# Altium project WS2812B_Bar.PrjPcb
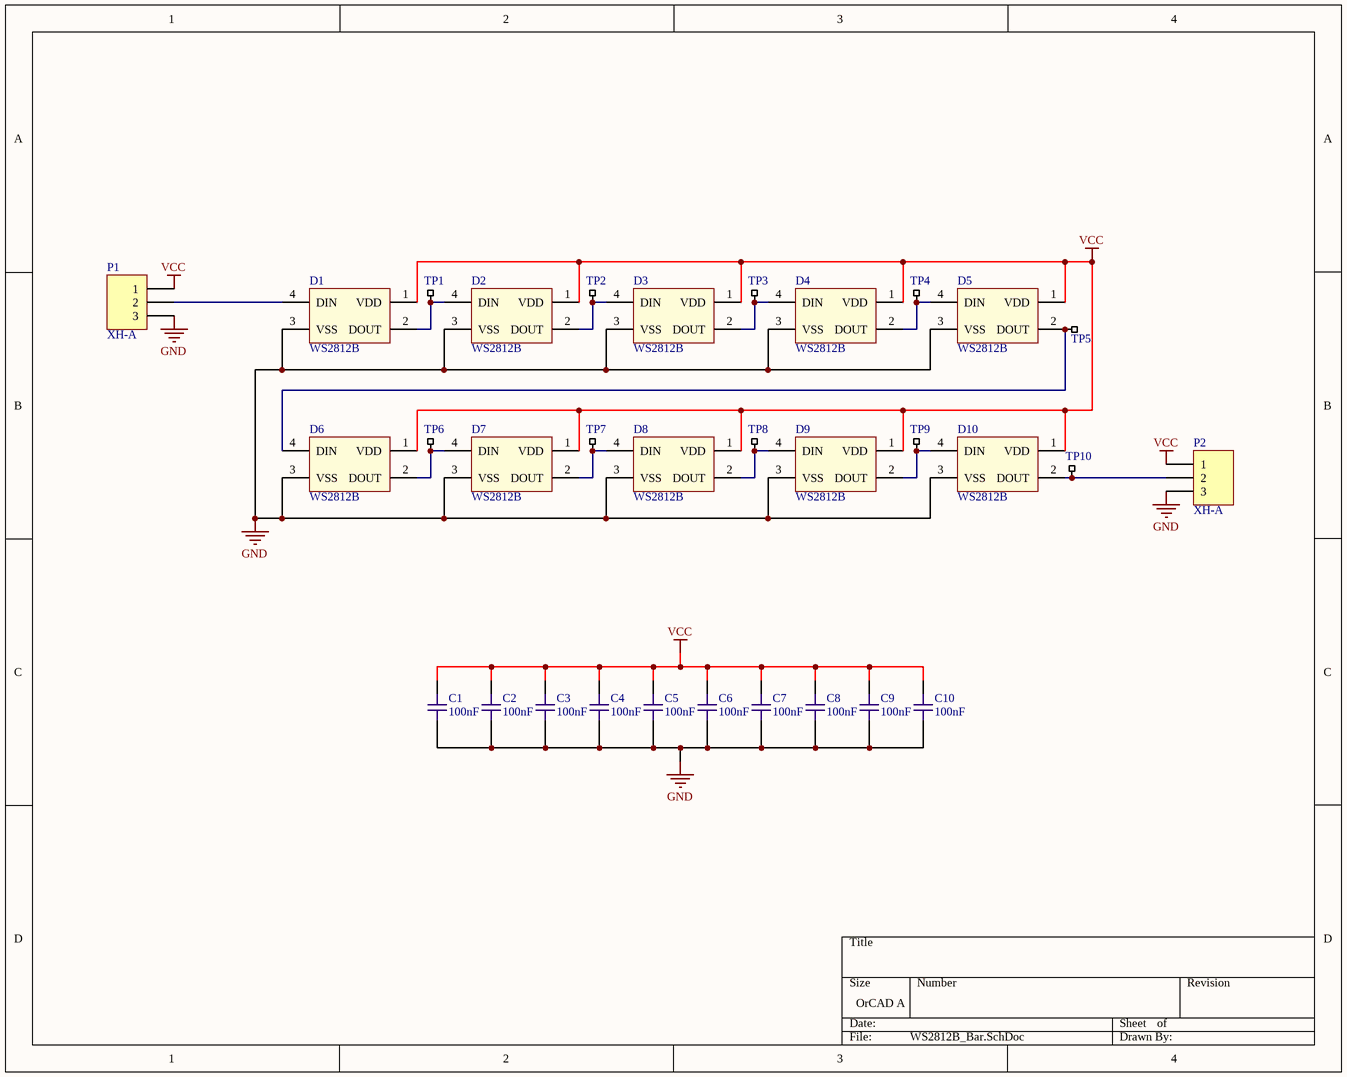
[diagram p0: WS2812B_Bar.SchDoc]
1 sheet, 32 parts. Net scope: global (net labels, ports and power ports of the same name join across sheets).
Board file: WS2812B_Bar.PcbDoc

## Sheet WS2812B_Bar.SchDoc
size OrCAD A

### Parts
C1  value 100nF  [C0603-IPC]  (hidden comment: C0603 100nF 25V X7R)
C2  value 100nF  [C0603-IPC]  (hidden comment: C0603 100nF 25V X7R)
C3  value 100nF  [C0603-IPC]  (hidden comment: C0603 100nF 25V X7R)
C4  value 100nF  [C0603-IPC]  (hidden comment: C0603 100nF 25V X7R)
C5  value 100nF  [C0603-IPC]  (hidden comment: C0603 100nF 25V X7R)
C6  value 100nF  [C0603-IPC]  (hidden comment: C0603 100nF 25V X7R)
C7  value 100nF  [C0603-IPC]  (hidden comment: C0603 100nF 25V X7R)
C8  value 100nF  [C0603-IPC]  (hidden comment: C0603 100nF 25V X7R)
C9  value 100nF  [C0603-IPC]  (hidden comment: C0603 100nF 25V X7R)
C10  value 100nF  [C0603-IPC]  (hidden comment: C0603 100nF 25V X7R)
D1  WS2812B  [WS2812B]
D2  WS2812B  [WS2812B]
D3  WS2812B  [WS2812B]
D4  WS2812B  [WS2812B]
D5  WS2812B  [WS2812B]
D6  WS2812B  [WS2812B]
D7  WS2812B  [WS2812B]
D8  WS2812B  [WS2812B]
D9  WS2812B  [WS2812B]
D10  WS2812B  [WS2812B]
P1  XH-A  [XH Header 1x3 SMD 2.5MM HORIZONTAL]
P2  XH-A  [XH Header 1x3 SMD 2.5MM HORIZONTAL]
TP1  Testpoint_SMT  [TESTPOINT_SMT]  (value not drawn)  (no BOM)
TP2  Testpoint_SMT  [TESTPOINT_SMT]  (value not drawn)  (no BOM)
TP3  Testpoint_SMT  [TESTPOINT_SMT]  (value not drawn)  (no BOM)
TP4  Testpoint_SMT  [TESTPOINT_SMT]  (value not drawn)  (no BOM)
TP5  Testpoint_SMT  [TESTPOINT_SMT]  (value not drawn)  (no BOM)
TP6  Testpoint_SMT  [TESTPOINT_SMT]  (value not drawn)  (no BOM)
TP7  Testpoint_SMT  [TESTPOINT_SMT]  (value not drawn)  (no BOM)
TP8  Testpoint_SMT  [TESTPOINT_SMT]  (value not drawn)  (no BOM)
TP9  Testpoint_SMT  [TESTPOINT_SMT]  (value not drawn)  (no BOM)
TP10  Testpoint_SMT  [TESTPOINT_SMT]  (value not drawn)  (no BOM)

### Nets
GND: C1.1 C2.1 C3.1 C4.1 C5.1 C6.1 C7.1 C8.1 C9.1 C10.1 D1.3(VSS) D2.3(VSS) D3.3(VSS) D4.3(VSS) D5.3(VSS) D6.3(VSS) D7.3(VSS) D8.3(VSS) D9.3(VSS) D10.3(VSS) P1.3 P2.3
VCC: C1.2 C2.2 C3.2 C4.2 C5.2 C6.2 C7.2 C8.2 C9.2 C10.2 D1.1(VDD) D2.1(VDD) D3.1(VDD) D4.1(VDD) D5.1(VDD) D6.1(VDD) D7.1(VDD) D8.1(VDD) D9.1(VDD) D10.1(VDD) P1.1 P2.1
NetD1_2: D1.2(DOUT) D2.4(DIN) TP1.1
NetD1_4: D1.4(DIN) P1.2
NetD2_2: D2.2(DOUT) D3.4(DIN) TP2.1
NetD3_2: D3.2(DOUT) D4.4(DIN) TP3.1
NetD4_2: D4.2(DOUT) D5.4(DIN) TP4.1
NetD5_2: D5.2(DOUT) D6.4(DIN) TP5.1
NetD6_2: D6.2(DOUT) D7.4(DIN) TP6.1
NetD7_2: D7.2(DOUT) D8.4(DIN) TP7.1
NetD8_2: D8.2(DOUT) D9.4(DIN) TP8.1
NetD9_2: D9.2(DOUT) D10.4(DIN) TP9.1
NetD10_2: D10.2(DOUT) P2.2 TP10.1

### Library data of the parts
C1-C10 = C0603 100nF 25V X7R: Chip Capacitor, 0603, 100nF, 25V, X7R; EIA Code: X7R; Max. Voltage: 25V; Supplier 1: Digi-Key; Supplier Part Number 1: 490-1524-1-ND
D1-D10 = WS2812B: Addressable Lighting - Discrete Serial Red, Green, Blue (RGB) 5.00mm L x 5.00mm WS2812B; Supplier 1: Digi-Key; Supplier 3: LCSC; Supplier Part Number 2: 485-1655; Supplier Part Number 1: 1528-1104-ND; Supplier 2: Mouser; Supplier Part Number 3: C114586
P1 P2 = JST XH 1x3: XH Header Male Pin 0.098"(2.50mm) 3 Wire To Board / Wire To Wire Connector; LatestRevisionDate: 17-Jul-2002; LatestRevisionNote: Re-released for DXP Platform.; Publisher: Altium Limited; Supplier 1: Digi-Key; Supplier Part Number 1: 455-2248-ND; Supplier 3: LCSC; Supplier Part Number 3: C144394
TP1-TP10 = Testpoint_SMT: SMT Test Point